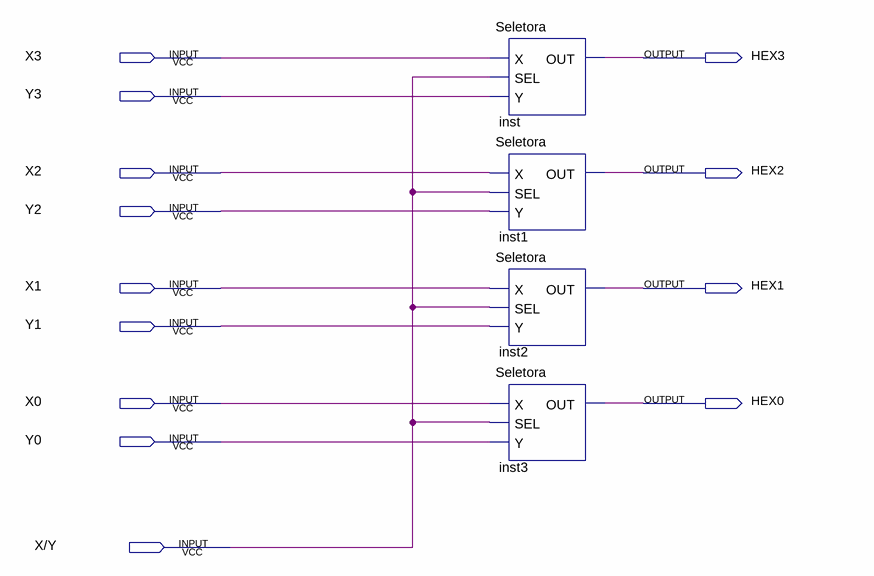
[diagram p0: schematic sheet]
// Quartus schematic MUX8x4.bdf as structural Verilog: 4 symbols, 13 pins
module MUX8x4 (
  input  X3,
  input  Y3,
  input  X2,
  input  Y2,
  input  X1,
  input  Y1,
  input  X0,
  input  Y0,
  input  \X/Y ,
  output HEX3,
  output HEX2,
  output HEX1,
  output HEX0
);

  Seletora inst (.X(X3), .SEL(\X/Y ), .Y(Y3), .OUT(HEX3));
  Seletora inst1 (.X(X2), .SEL(\X/Y ), .Y(Y2), .OUT(HEX2));
  Seletora inst2 (.X(X1), .SEL(\X/Y ), .Y(Y1), .OUT(HEX1));
  Seletora inst3 (.X(X0), .SEL(\X/Y ), .Y(Y0), .OUT(HEX0));
endmodule
